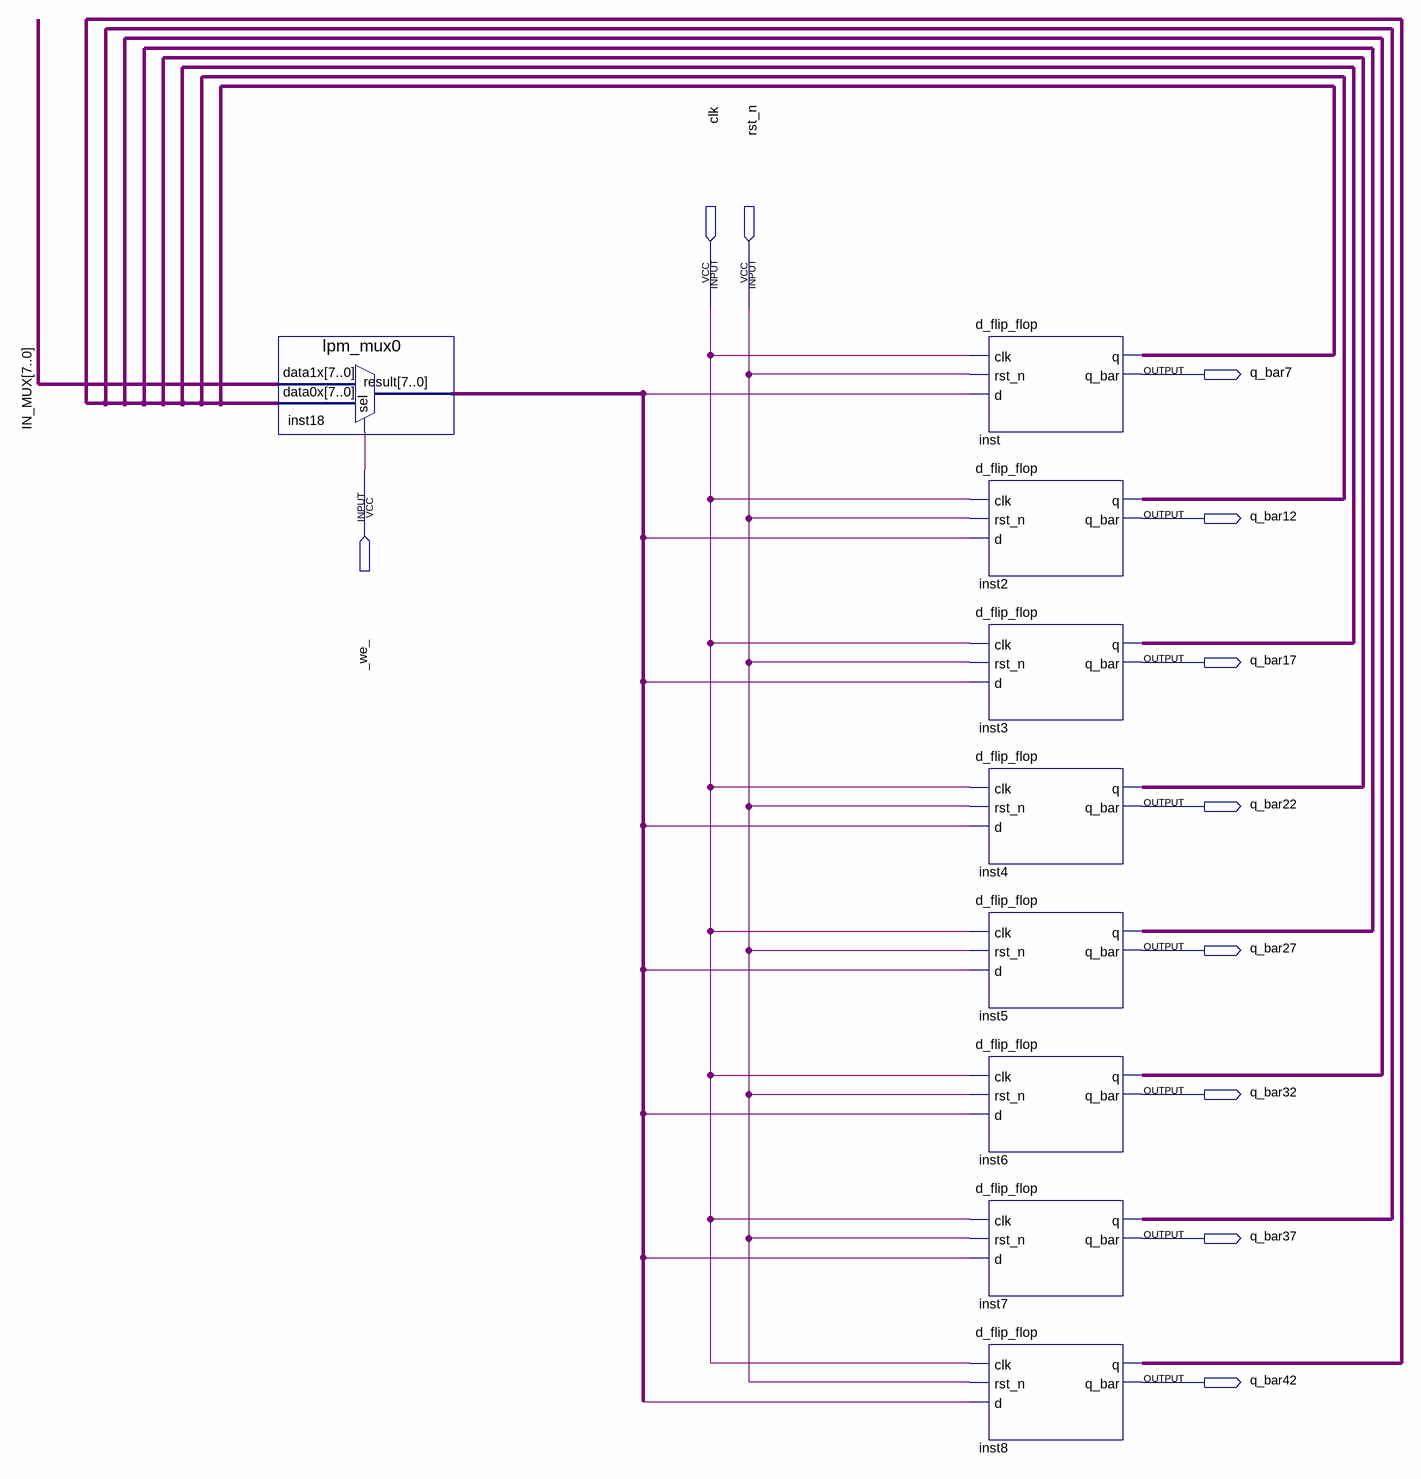
[diagram p0: schematic sheet]
// Quartus schematic muxdff.bdf as structural Verilog: 9 symbols, 11 pins
module muxdff (
  input  clk,
  input  rst_n,
  input  _we_,
  output q_bar7,
  output q_bar12,
  output q_bar17,
  output q_bar22,
  output q_bar27,
  output q_bar32,
  output q_bar37,
  output q_bar42
);

  wire undriven, undriven_2, undriven_3, undriven_4, undriven_5, undriven_6, undriven_7, undriven_8;
  wire [7:0] IN_MUX, inst18_result, inst_q;

  lpm_mux0 inst18 (.data1x(IN_MUX), .data0x(inst_q), .sel(_we_), .result(inst18_result));
  d_flip_flop inst (.clk(clk), .rst_n(rst_n), .d(undriven_8), .q(inst_q), .q_bar(q_bar7));
  d_flip_flop inst2 (.clk(clk), .rst_n(rst_n), .d(undriven_6), .q(inst_q), .q_bar(q_bar12));
  d_flip_flop inst3 (.clk(clk), .rst_n(rst_n), .d(undriven_5), .q(inst_q), .q_bar(q_bar17));
  d_flip_flop inst4 (.clk(clk), .rst_n(rst_n), .d(undriven_7), .q(inst_q), .q_bar(q_bar22));
  d_flip_flop inst5 (.clk(clk), .rst_n(rst_n), .d(undriven), .q(inst_q), .q_bar(q_bar27));
  d_flip_flop inst6 (.clk(clk), .rst_n(rst_n), .d(undriven_2), .q(inst_q), .q_bar(q_bar32));
  d_flip_flop inst7 (.clk(clk), .rst_n(rst_n), .d(undriven_3), .q(inst_q), .q_bar(q_bar37));
  d_flip_flop inst8 (.clk(clk), .rst_n(rst_n), .d(undriven_4), .q(inst_q), .q_bar(q_bar42));
endmodule
